# Altium project Kstepwatch.PrjPcb
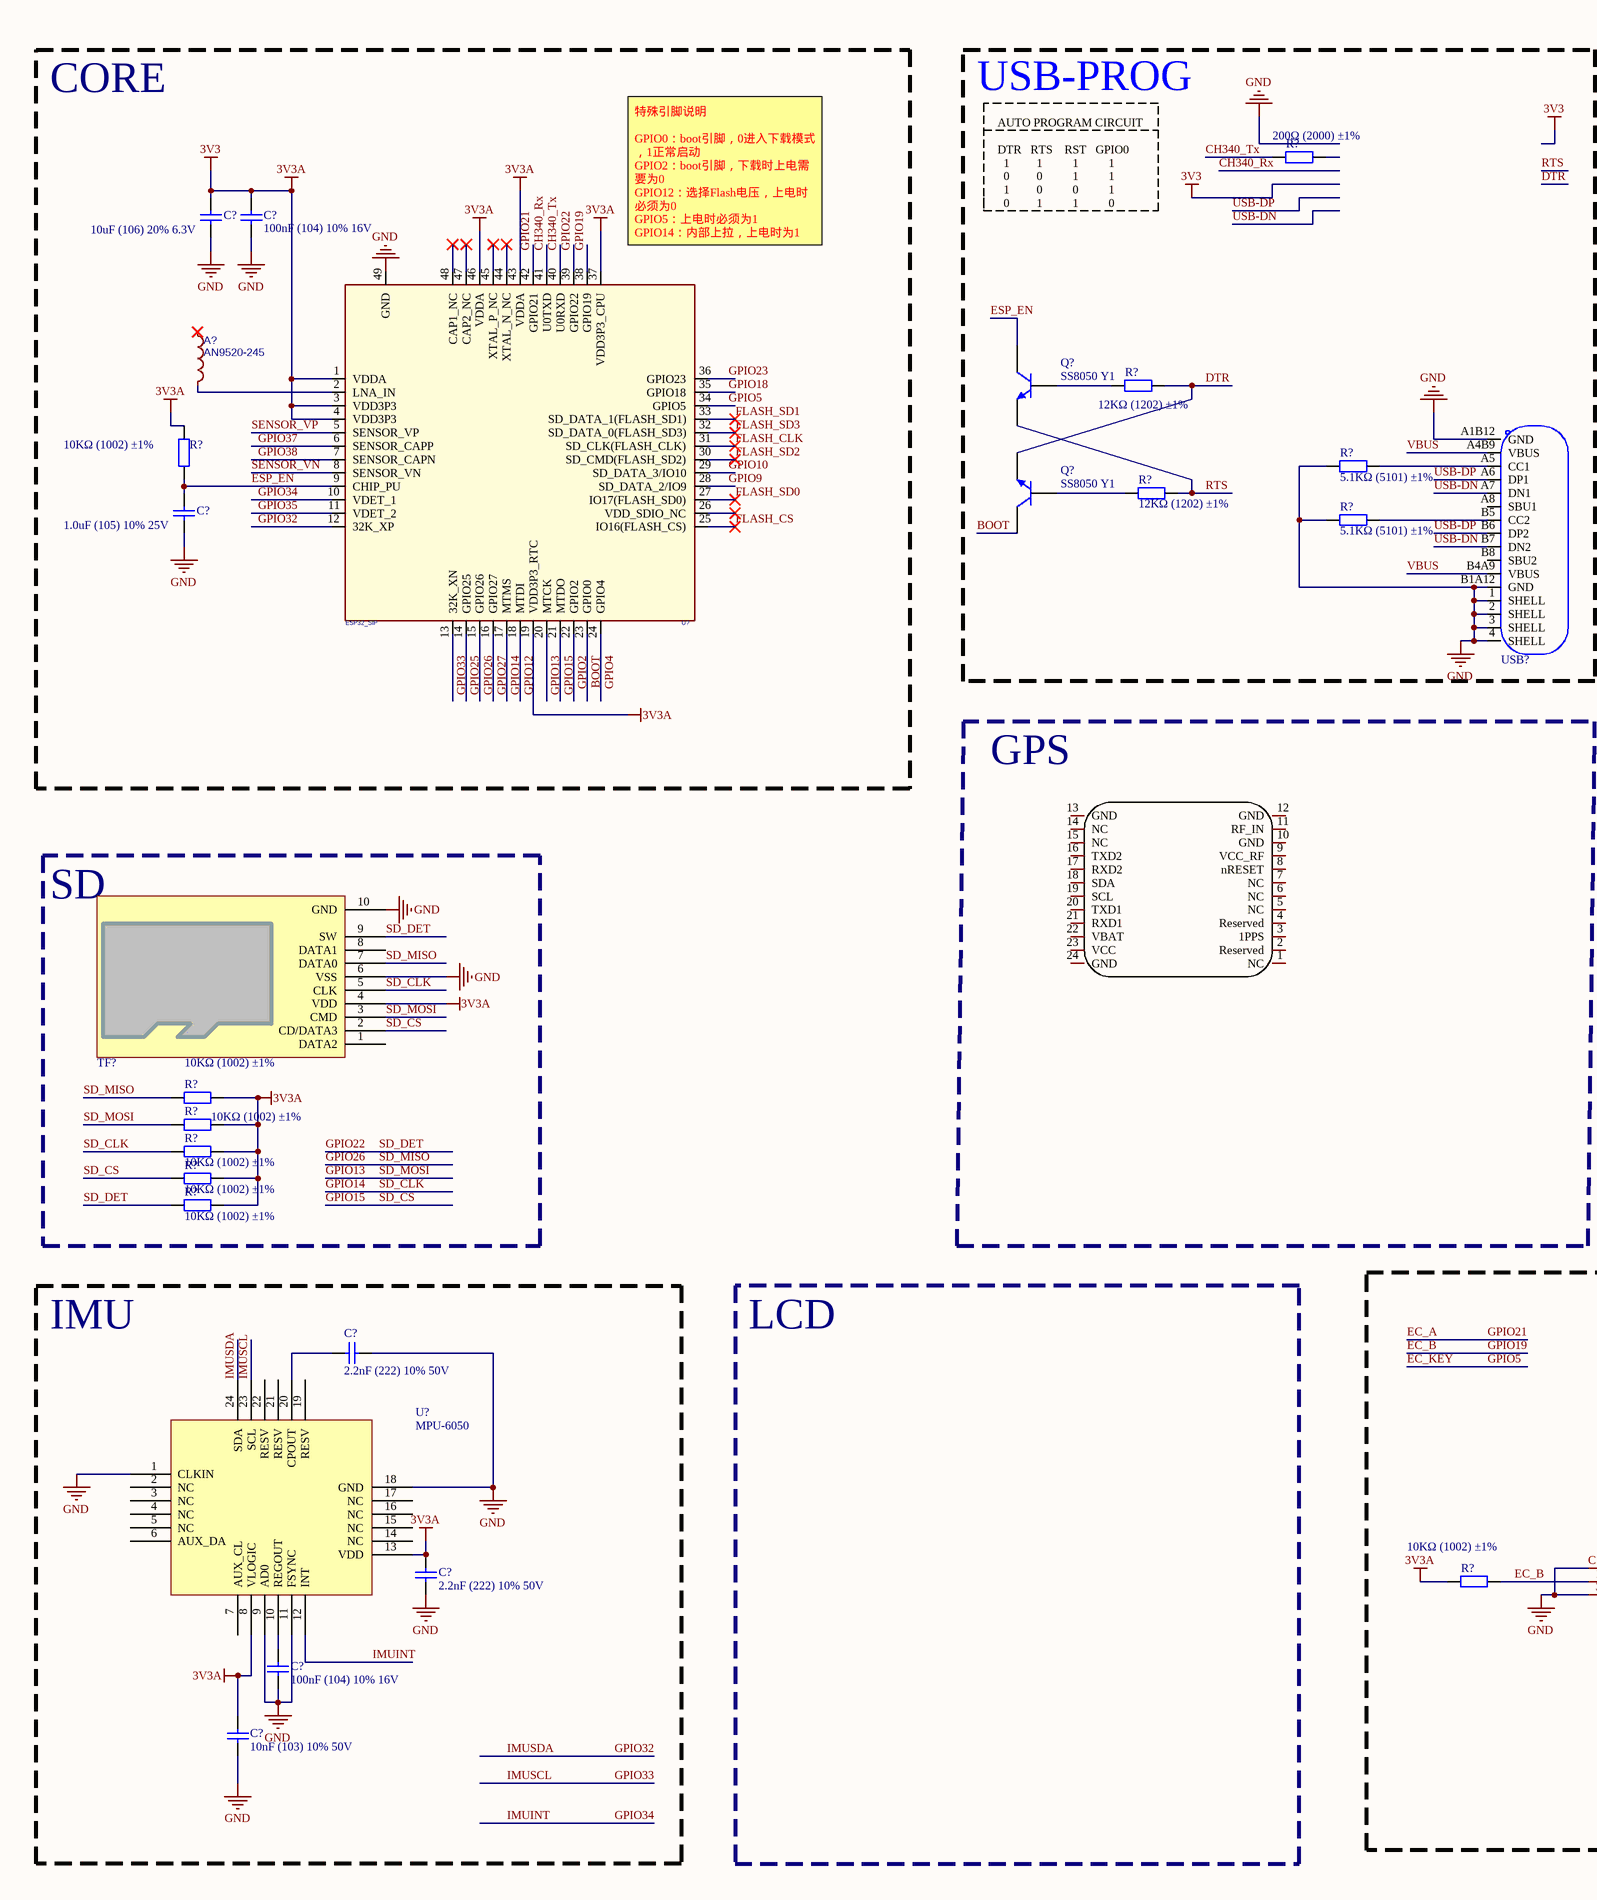
[diagram p0: Main.SchDoc, left]
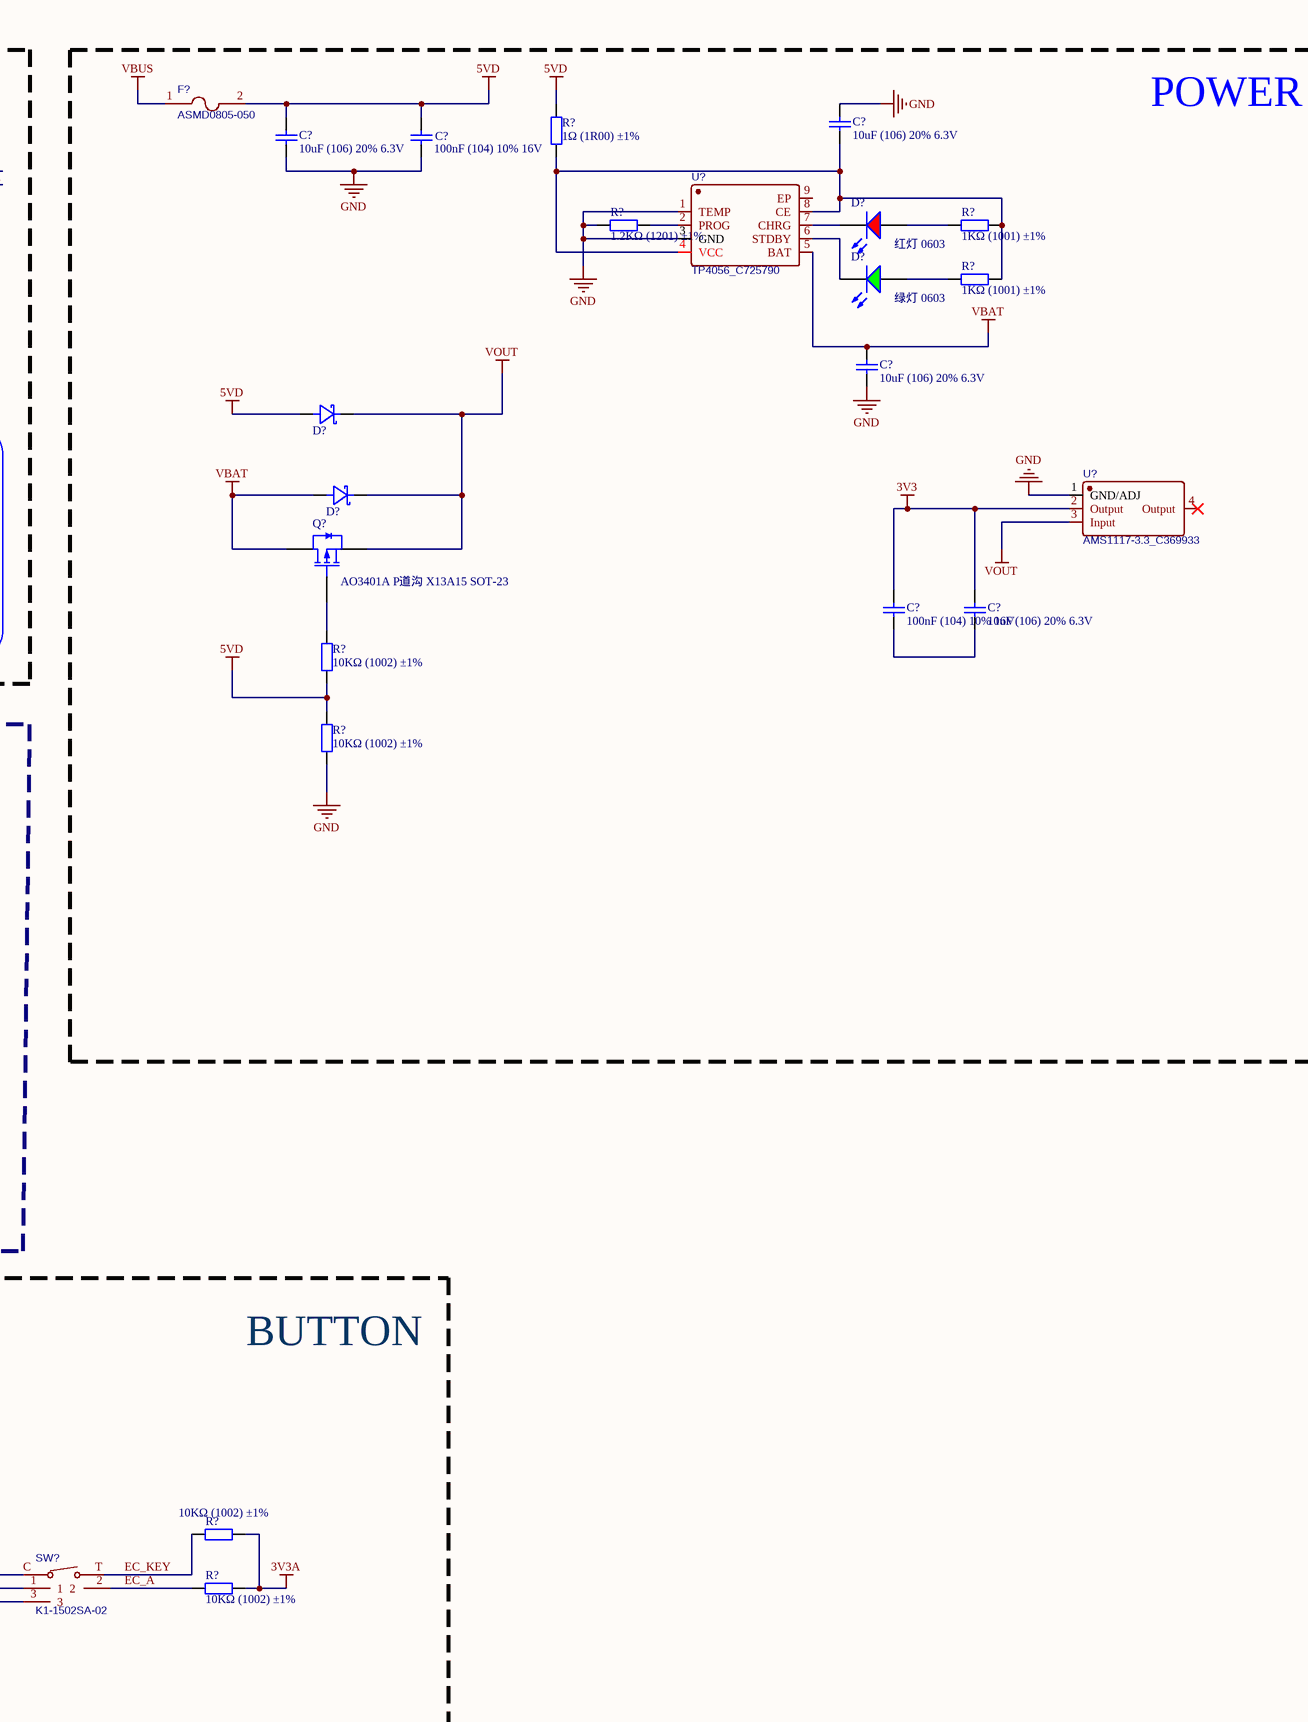
[diagram p1: Main.SchDoc, right]
1 sheet, 50 parts. Net scope: global (net labels, ports and power ports of the same name join across sheets).

## Sheet Main.SchDoc
size A2; SheetNumber: 1; SheetTotal: 1

### Parts
(Parts that share a designator on the sheet are numbered #1, #2 ... from top to bottom, then left to right.)
A?  AN9520-245  [ANT-SMD_L9.5-W2.1]
C?#1  10uF (106) 20% 6.3V  [0402_C]
C?#2  10uF (106) 20% 6.3V  [0402_C]
C?#3  100nF (104) 10% 16V  [0402_C]
C?#4  10uF (106) 20% 6.3V  [0402_C]
C?#5  100nF (104) 10% 16V  [0402_C]
C?#6  10uF (106) 20% 6.3V  [0402_C]
C?#7  1.0uF (105) 10% 25V  [0402_C]
C?#8  100nF (104) 10% 16V  [0402_C]
C?#9  10uF (106) 20% 6.3V  [0402_C]
C?#10  2.2nF (222) 10% 50V  [0402_C]
C?#11  2.2nF (222) 10% 50V  [0402_C]
C?#12  100nF (104) 10% 16V  [0402_C]
C?#13  10nF (103) 10% 50V  [0402_C]
D?#1  红灯 0603  [0603_LED_S1]
D?#2  绿灯 0603  [0603_LED_S1]
D?#3  1N5819W  [SOD-123]  (value not drawn)
D?#4  1N5819W  [SOD-123]  (value not drawn)
F?  ASMD0805-050  [ASMD0805]
Q?#1  SS8050 Y1  [SOT-23(SOT-23-3)]
Q?#2  SS8050 Y1  [SOT-23(SOT-23-3)]
Q?#3  AO3401A P道沟 X13A15 SOT-23  [SOT-23-3L]
R?#1  1Ω (1R00) ±1%  [0402_R]
R?#2  200Ω (2000) ±1%  [0402_R]
R?#3  1.2KΩ (1201) ±1%  [0402_R]
R?#4  1KΩ (1001) ±1%  [0402_R]
R?#5  1KΩ (1001) ±1%  [0402_R]
R?#6  12KΩ (1202) ±1%  [0402_R]
R?#7  10KΩ (1002) ±1%  [0402_R]
R?#8  5.1KΩ (5101) ±1%  [0402_R]
R?#9  12KΩ (1202) ±1%  [0402_R]
R?#10  5.1KΩ (5101) ±1%  [0402_R]
R?#11  10KΩ (1002) ±1%  [0402_R]
R?#12  10KΩ (1002) ±1%  [0402_R]
R?#13  10KΩ (1002) ±1%  [0402_R]
R?#14  10KΩ (1002) ±1%  [0402_R]
R?#15  10KΩ (1002) ±1%  [0402_R]
R?#16  10KΩ (1002) ±1%  [0402_R]
R?#17  10KΩ (1002) ±1%  [0402_R]
R?#18  10KΩ (1002) ±1%  [0402_R]
R?#19  10KΩ (1002) ±1%  [0402_R]
R?#20  10KΩ (1002) ±1%  [0402_R]
SW?  K1-1502SA-02  [KEY-SMD_K1-1502SA-02]
TF?  TF  [TF-SMD_THD2528]  (value not drawn)
U?#1  TP4056_C725790  [ESOP-8_TP4056]
U?#2  ESP32_SIP  [QFN-48_7X7]
U?#3  AMS1117-3.3_C369933  [SOT-223-AMS1117]
U?#4  ATGM332D-5NR32  [GSM-SMD_ATGM332D-5N11]  (value not drawn)
U?#5  MPU-6050  [QFN-24_4x4x05P]
USB?  TYPE-C16PIN  [TYPE-C-SMD]  (value not drawn)

### Blocks framed on the sheet
CORE: A? C?#4 C?#5 C?#7 R?#7 U?#2
POWER: C?#1-C?#3 C?#6 C?#8 C?#9 D?#1-D?#4 F? Q?#3 R?#1 R?#3-R?#5 R?#11 R?#12 U?#1 U?#3
SD: R?#13-R?#17 TF?
IMU: C?#10-C?#13 U?#5

### Nets
3V3: C?#4.2 C?#5.2 C?#8.2 C?#9.2 C?#11.2 C?#13.2 R?#7.2 R?#13.2 R?#14.2 R?#15.2 R?#16.2 R?#17.2 R?#18.2 R?#19.1 R?#20.2 TF?.4(VDD) U?#2.1(VDDA) U?#2.3(VDD3P3) U?#2.4(VDD3P3) U?#2.19(VDD3P3_RTC) U?#2.37(VDD3P3_CPU) U?#2.43(VDDA) U?#2.46(VDDA) U?#3.2(Output) U?#5.8(VLOGIC) U?#5.13(VDD)  [also labelled 3V3A]
5VD: C?#2.2 C?#3.2 D?#3.2(A) F?.2 R?#1.1 R?#11.1 R?#12.2
GND: C?#1.2 C?#2.1 C?#3.1 C?#4.1 C?#5.1 C?#6.1 C?#7.1 C?#10.2 C?#11.1 C?#12.1 C?#13.1 R?#3.1 R?#8.1 R?#10.1 R?#12.1 SW?.3 SW?.C TF?.6(VSS) TF?.10(GND) U?#1.1(TEMP) U?#1.3(GND) U?#2.49(GND) U?#3.1(GND/ADJ) U?#5.1(CLKIN) U?#5.9(AD0) U?#5.11(FSYNC) U?#5.18(GND) USB?.1(SHELL) USB?.2(SHELL) USB?.3(SHELL) USB?.4(SHELL) USB?.A1B12(GND) USB?.B1A12(GND)
VBAT: C?#6.2 D?#4.2(A) Q?#3.3(D) U?#1.5(BAT)
VBUS: F?.1 USB?.A4B9(VBUS) USB?.B4A9(VBUS)
VOUT: D?#3.1(C) D?#4.1(C) Q?#3.2(S) U?#3.3(Input)
BOOT: Q?#2.3(C) U?#2.23(GPIO0)
CH340_Rx: U?#2.41(U0TXD)
CH340_Tx: R?#2.1 U?#2.40(U0RXD)
DTR: Q?#2.2(E) R?#6.2
EC_A: R?#20.1 SW?.2 U?#2.42(GPIO21)  [also labelled GPIO21]
EC_B: R?#19.2 SW?.1 U?#2.38(GPIO19)  [also labelled GPIO19]
EC_KEY: R?#18.1 SW?.T U?#2.34(GPIO5)  [also labelled GPIO5]
ESP_EN: C?#7.2 Q?#1.3(C) R?#7.1 U?#2.9(CHIP_PU)
FLASH_CLK: U?#2.31(SD_CLK(FLASH_CLK))
FLASH_CS: U?#2.25(IO16(FLASH_CS))
FLASH_SD0: U?#2.27(IO17(FLASH_SD0))
FLASH_SD1: U?#2.33(SD_DATA_1(FLASH_SD1))
FLASH_SD2: U?#2.30(SD_CMD(FLASH_SD2))
FLASH_SD3: U?#2.32(SD_DATA_0(FLASH_SD3))
GPIO2: U?#2.22(GPIO2)
GPIO4: U?#2.24(GPIO4)
GPIO9: U?#2.28(SD_DATA_2/IO9)
GPIO10: U?#2.29(SD_DATA_3/IO10)
GPIO12: U?#2.18(MTDI)
GPIO13: R?#14.1 TF?.3(CMD) U?#2.20(MTCK)  [also labelled SD_MOSI]
GPIO14: R?#15.1 TF?.5(CLK) U?#2.17(MTMS)  [also labelled SD_CLK]
GPIO15: R?#16.1 TF?.2(CD/DATA3) U?#2.21(MTDO)  [also labelled SD_CS]
GPIO18: U?#2.35(GPIO18)
GPIO22: R?#17.1 TF?.9(SW) U?#2.39(GPIO22)  [also labelled SD_DET]
GPIO23: U?#2.36(GPIO23)
GPIO25: U?#2.14(GPIO25)
GPIO26: R?#13.1 TF?.7(DATA0) U?#2.15(GPIO26)  [also labelled SD_MISO]
GPIO27: U?#2.16(GPIO27)
GPIO32: U?#2.12(32K_XP) U?#5.24(SDA)  [also labelled IMUSDA]
GPIO33: U?#2.13(32K_XN) U?#5.23(SCL)  [also labelled IMUSCL]
GPIO34: U?#2.10(VDET_1) U?#5.12(INT)  [also labelled IMUINT]
GPIO35: U?#2.11(VDET_2)
GPIO37: U?#2.6(SENSOR_CAPP)
GPIO38: U?#2.7(SENSOR_CAPN)
RTS: Q?#1.2(E) R?#9.2
SENSOR_VN: U?#2.8(SENSOR_VN)
SENSOR_VP: U?#2.5(SENSOR_VP)
USB-DN: USB?.A7(DN1) USB?.B7(DN2)
USB-DP: USB?.A6(DP1) USB?.B6(DP2)
NetA?_2: A?.2 U?#2.2(LNA_IN)
NetC?#1_1: C?#1.1 R?#1.2 R?#4.2 R?#5.2 U?#1.4(VCC) U?#1.8(CE)
NetC?#8_1: C?#8.1 C?#9.1
NetC?#10_1: C?#10.1 U?#5.20(CPOUT)
NetC?#12_2: C?#12.2 U?#5.10(REGOUT)
NetD?#1_A: D?#1.A R?#4.1
NetD?#1_K: D?#1.K U?#1.7(CHRG)
NetD?#2_A: D?#2.A R?#5.1
NetD?#2_K: D?#2.K U?#1.6(STDBY)
NetQ?#1_1: Q?#1.1(B) R?#6.1
NetQ?#2_1: Q?#2.1(B) R?#9.1
NetQ?#3_1: Q?#3.1(G) R?#11.2
NetR?#3_2: R?#3.2 U?#1.2(PROG)
NetR?#8_2: R?#8.2 USB?.A5(CC1)
NetR?#10_2: R?#10.2 USB?.B5(CC2)

Not connected (* = marked no-connect by the designer): A? 1*; R?#2 2; TF? 1(DATA2) 8(DATA1); U?#1 9(EP); U?#2 26(VDD_SDIO_NC)* 44(XTAL_N_NC)* 45(XTAL_P_NC)* 47(CAP2_NC)* 48(CAP1_NC)*; U?#3 4(Output)*; U?#4 1(NC) 2(Reserved) 3(1PPS) 4(Reserved) 5(NC) 6(NC) 7(NC) 8(nRESET) 9(VCC_RF) 10(GND) 11(RF_IN) 12(GND) 13(GND) 14(NC) 15(NC) 16(TXD2) 17(RXD2) 18(SDA) 19(SCL) 20(TXD1) 21(RXD1) 22(VBAT) 23(VCC) 24(GND); U?#5 2(NC) 3(NC) 4(NC) 5(NC) 6(AUX_DA) 7(AUX_CL) 14(NC) 15(NC) 16(NC) 17(NC) 19(RESV) 21(RESV) 22(RESV); USB? A8(SBU1) B8(SBU2)

### Notes on the sheet
- Text
- USB-PROG
- AUTO PROGRAM CIRCUIT
  DTR   RTS    RST   GPIO0
  1         1          1          1
  0         0          1          1
  1         0          0          1
  0         1          1          0
- (near U?#2) 特殊引脚说明
  GPIO0：boot引脚，0进入下载模式，1正常启动
  GPIO2：boot引脚，下载时上电需要为0
  GPIO12：选择Flash电压，上电时必须为0
  GPIO5：上电时必须为1
  GPIO14：内部上拉，上电时为1
  GPIO15：上电时必须为1
- (near U?#4) GPS
- LCD
- BUTTON

### Library data of the parts
A? = AN9520-245: 陶瓷wifi/bt天线; BOM_Manufacturer: Rainsun; BOM_Supplier: LCSC; BOM_Manufacturer Part: AN9520-245; BOM_Supplier Part: C99665; BOM_JLCPCB Part Class: Extended Part; spicePre: L; spiceSymbolName: AN9520-245
C?#1 C?#2 C?#4 C?#6 C?#9 = 0402 10uF (106) 20% 6.3V: 贴片电容; ComponentLink1Description: 供应商链接; ComponentLink1URL: http://www.szlcsc.com/product/details_16204.html; Package: 0402; Supplier: LC; SuppliersPartNumber: C15525
C?#3 C?#5 C?#8 C?#12 = 0402 100nF (104) 10% 16V: 贴片电容; ComponentLink1Description: 供应商链接; ComponentLink1URL: http://www.szlcsc.com/product/details_1877.html; Package: 0402; Supplier: LC; SuppliersPartNumber: C1525
C?#7 = 0402 1.0uF (105) 10% 25V: 贴片电容; ComponentLink1Description: 供应商链接; ComponentLink1URL: http://www.szlcsc.com/product/details_53938.html; Package: 0402; Supplier: LC; SuppliersPartNumber: C52923
C?#10 C?#11 = 0402 2.2nF (222) 10% 50V: 贴片电容; ComponentLink1Description: 供应商链接; ComponentLink1URL: http://www.szlcsc.com/product/details_1883.html; Package: 0402; Supplier: LC; SuppliersPartNumber: C1531
C?#13 = 0402 10nF (103) 10% 50V: 贴片电容; ComponentLink1Description: 供应商链接; ComponentLink1URL: http://www.szlcsc.com/product/details_15869.html; Package: 0402; Supplier: LC; SuppliersPartNumber: C15195
D?#1 = 0603 红灯: 发光二极管; ComponentLink1Description: 供应商链接; ComponentLink1URL: http://www.szlcsc.com/product/details_2659.html; Package: 0603; Supplier: LC; SuppliersPartNumber: C2286
D?#2 = 0603 绿灯: 发光二极管; ComponentLink1Description: 供应商链接; ComponentLink1URL: http://www.szlcsc.com/product/details_73152.html; Package: 0603; Supplier: LC; SuppliersPartNumber: C72043
D?#3 D?#4 = 1N5819W: 二极管; Manufacturer: TWGMC(台湾迪嘉); Symbol: 1N5819W_C727115; Add into BOM: yes; Diode Configuration: 独立式; Reverse Voltage (Vr): 40V; Average Rectified Current (Io): 1A; Forward Voltage (Vf@If): 900mV@3A; Reverse Leakage Current (Ir): 1mA@40V; Device: 1N5819W_C727115; LCSC Part Name: 40V 1A 900mV@3A; Supplier Part: C727115; Manufacturer Part: 1N5819W; Supplier Footprint: SOD-123; JLCPCB Part Class: Extended Part; Datasheet: https://atta.szlcsc.com/upload/public/pdf/source/20200828/C727113_260B72EC53C389C21DF1E8AB243F1BFC.pdf; Supplier: LCSC; Convert to PCB: yes
F? = ASMD0805-050: BOM_Manufacturer: JDTFUSE; Contributor: LCSC; BOM_Supplier: LCSC; BOM_Manufacturer Part: ASMD0805-050; BOM_Supplier Part: C135329; BOM_JLCPCB Part Class: Extended Part; spicePre: F; spiceSymbolName: ASMD0805-050
Q?#1 Q?#2 = SOT-23 SS8050 Y1: 三极管; ComponentLink1Description: 供应商链接; ComponentLink1URL: http://www.szlcsc.com/product/details_2507.html; Package: SOT-23; Supplier: LC; SuppliersPartNumber: C2150
Q?#3 = AO3401A P道沟 X13A15 SOT-23: MOS(场效应管); ComponentLink1Description: 供应商链接; ComponentLink1URL: http://www.szlcsc.com/product/details_15801.html; Package: SOT-23; Supplier: LC; SuppliersPartNumber: C15127
R?#1 = 0402 1Ω (1R00) 1%: 贴片电阻; ComponentLink1Description: 供应商链接; ComponentLink1URL: http://www.szlcsc.com/product/details_25829.html; Package: 0402; Supplier: LC; SuppliersPartNumber: C25086
R?#2 = 0402 200Ω (2000) 1%: 贴片电阻; ComponentLink1Description: 供应商链接; ComponentLink1URL: http://www.szlcsc.com/product/details_25830.html; Package: 0402; Supplier: LC; SuppliersPartNumber: C25087
R?#3 = 0402 1.2KΩ (1201) 1%: 贴片电阻; ComponentLink1Description: 供应商链接; ComponentLink1URL: http://www.szlcsc.com/product/details_26605.html; Package: 0402; Supplier: LC; SuppliersPartNumber: C25862
R?#4 R?#5 = 0402 1KΩ (1001) 1%: 贴片电阻; ComponentLink1Description: 供应商链接; ComponentLink1URL: http://www.szlcsc.com/product/details_12256.html; Package: 0402; Supplier: LC; SuppliersPartNumber: C11702
R?#6 R?#9 = 0402 12KΩ (1202) 1%: 贴片电阻; ComponentLink1Description: 供应商链接; ComponentLink1URL: http://www.szlcsc.com/product/details_26495.html; Package: 0402; Supplier: LC; SuppliersPartNumber: C25752
R?#7 R?#11-R?#20 = 0402 10KΩ (1002) 1%: 贴片电阻; ComponentLink1Description: 供应商链接; ComponentLink1URL: http://www.szlcsc.com/product/details_26487.html; Package: 0402; Supplier: LC; SuppliersPartNumber: C25744
R?#8 R?#10 = 0402 5.1KΩ (5101) 1%: 贴片电阻; ComponentLink1Description: 供应商链接; ComponentLink1URL: http://www.szlcsc.com/product/details_26648.html; Package: 0402; Supplier: LC; SuppliersPartNumber: C25905
SW? = K1-1502SA-02: 拨码开关; BOM_Manufacturer: Rectangular Connectors - Contacts; Contributor: LCSC; BOM_Supplier: LCSC; BOM_Supplier Part: C128929; BOM_Manufacturer Part: K1-1502SA-02; BOM_JLCPCB Part Class: Extended Part; spicePre: S; spiceSymbolName: K1-1502SA-02
TF? = TF卡座: 8脚自弹
U?#1 = TP4056: BOM_Manufacturer: UMW(Youtai Semiconductor Co., Ltd.); Contributor: LCSC; BOM_Supplier: LCSC; BOM_Supplier Part: C725790; BOM_Manufacturer Part: TP4056; BOM_JLCPCB Part Class: Extended Part; spicePre: U; spiceSymbolName: TP4056_C725790
U?#2 = ESP32-PICO
U?#3 = AMS1117-3.3: BOM_Manufacturer: KEXIN; Contributor: LCSC; BOM_Paste Type: expand; BOM_Supplier: LCSC; BOM_Supplier Part: C369933; BOM_Manufacturer Part: AMS1117-3.3; spicePre: U; spiceSymbolName: AMS1117-3.3_C369933
U?#4 = ATGM332D-5NR32: Manufacturer: 杭州中科微; Add into BOM: yes; Name: ATGM332D-5NR32; Symbol: ATGM332D-5NR32; Device: ATGM332D-5NR32; LCSC Part Name: BDS/GNSS 全星座定位导航模块; Supplier Part: C3037611; Manufacturer Part: ATGM332D-5NR32; Supplier Footprint: -; JLCPCB Part Class: Extended Part; Datasheet: https://atta.szlcsc.com/upload/public/pdf/source/20220623/89B350A4689FD8DAA801C638D9ED4BB8.pdf; Supplier: LCSC; Convert to PCB: yes
U?#5 = MPU-6050_[C24112]: 传感器; ComponentLink1Description: 供应商链接; ComponentLink1URL: http://www.szlcsc.com/product/details_24852.html; Package: QFN-24_4x4x05P; Supplier: LC; SuppliersPartNumber: C24112
USB? = TYPE-C16PIN: Manufacturer: SHOU HAN(首韩); Add into BOM: yes; Connector Type: Type-C; Gender: 母座; Number of Contacts: 16; Number of Ports: 1; Current Rating - Power (Max): 3A; Symbol: TYPE-C16PIN; Device: TYPE-C16PIN; LCSC Part Name: Type-C 母座 卧贴 快充闪充 停产; Supplier Part: C393939; Manufacturer Part: TYPE-C16PIN; Supplier Footprint: SMD; JLCPCB Part Class: Extended Part; Datasheet: https://atta.szlcsc.com/upload/public/pdf/source/20190521/C393939_7B9043D4CF1026AF443AB60D91FBCD5C.pdf; Supplier: LCSC; Convert to PCB: yes; Standard: -; Mounting Style: 卧贴; Operating Temperature Range: -40~+85